# EasyEDA Pro project ProPrj_功率计_2025-02-24.epro

# Schematic Schematic1

## Sheets
1 主控: Create Date: 2023-10-29; Page Name: 主控; Project Name: 功率计; Schematic Name: Schematic1; Update Date: 2024-02-28; Company: 嘉立创EDA; Page Size: A4; Version: V1.0
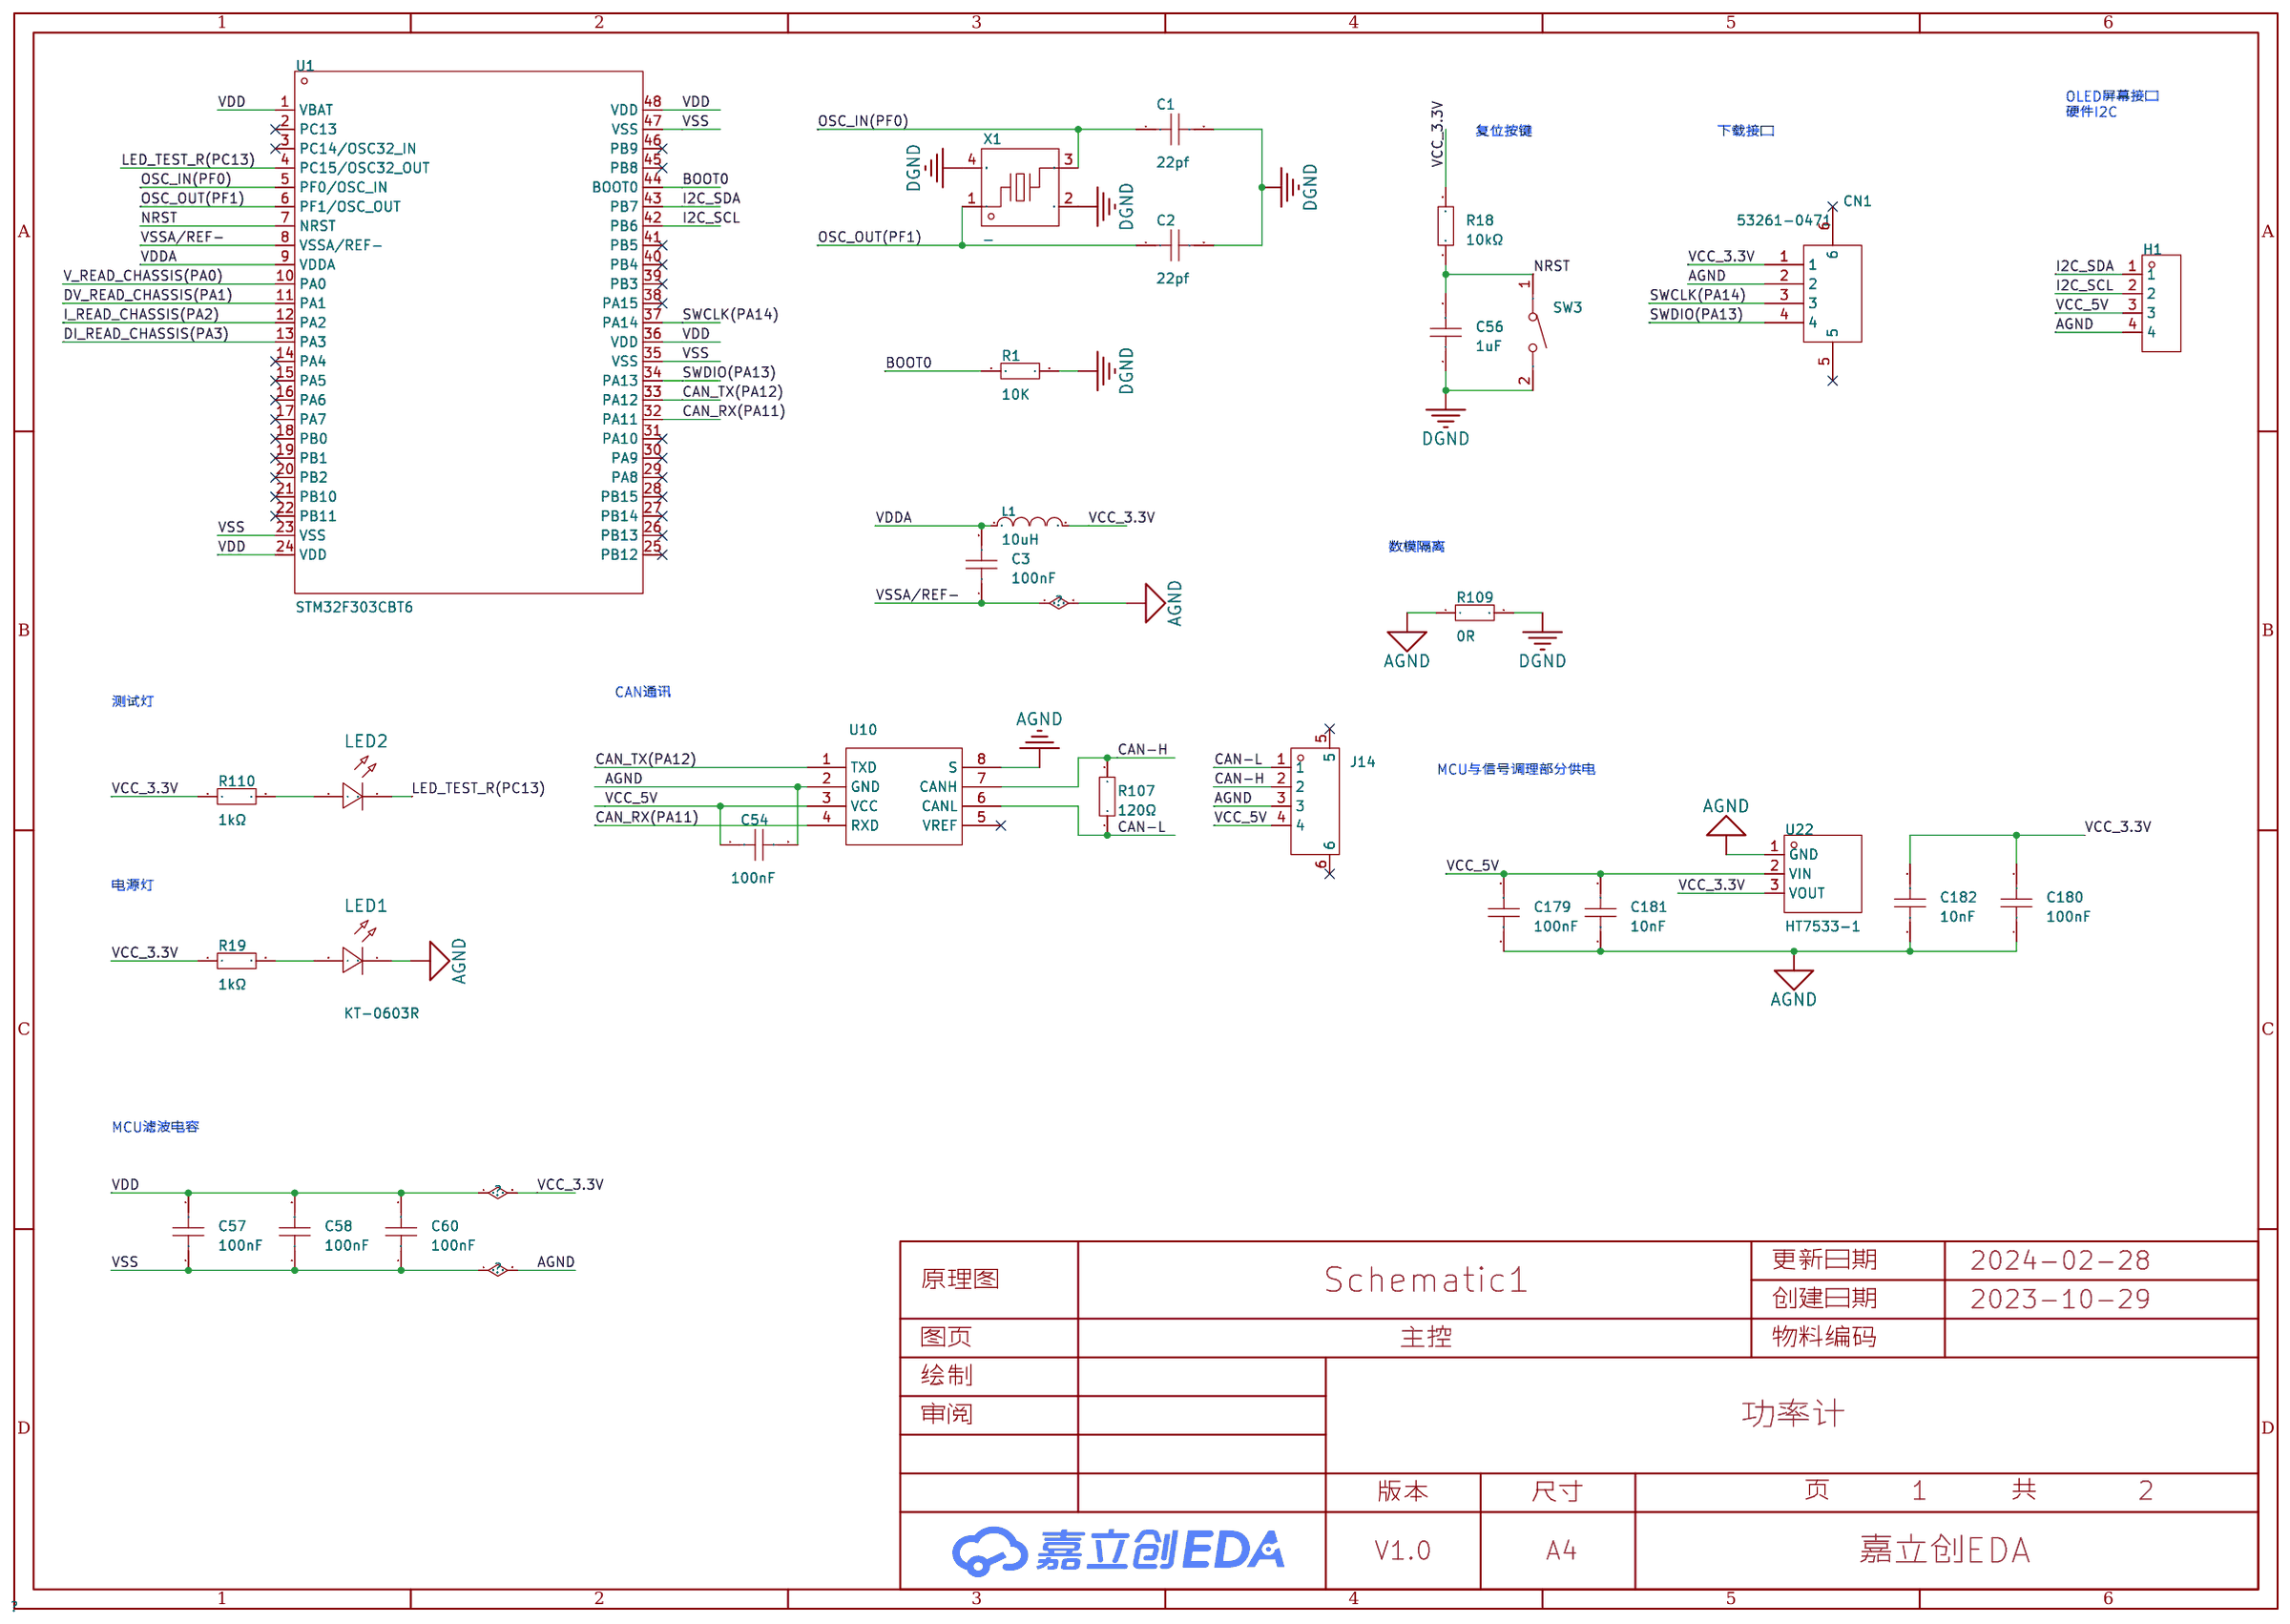
[diagram p0: 主控]
2 信号调理部分: Create Date: 2023-10-30; Page Name: 信号调理部分; Update Date: 2024-03-06
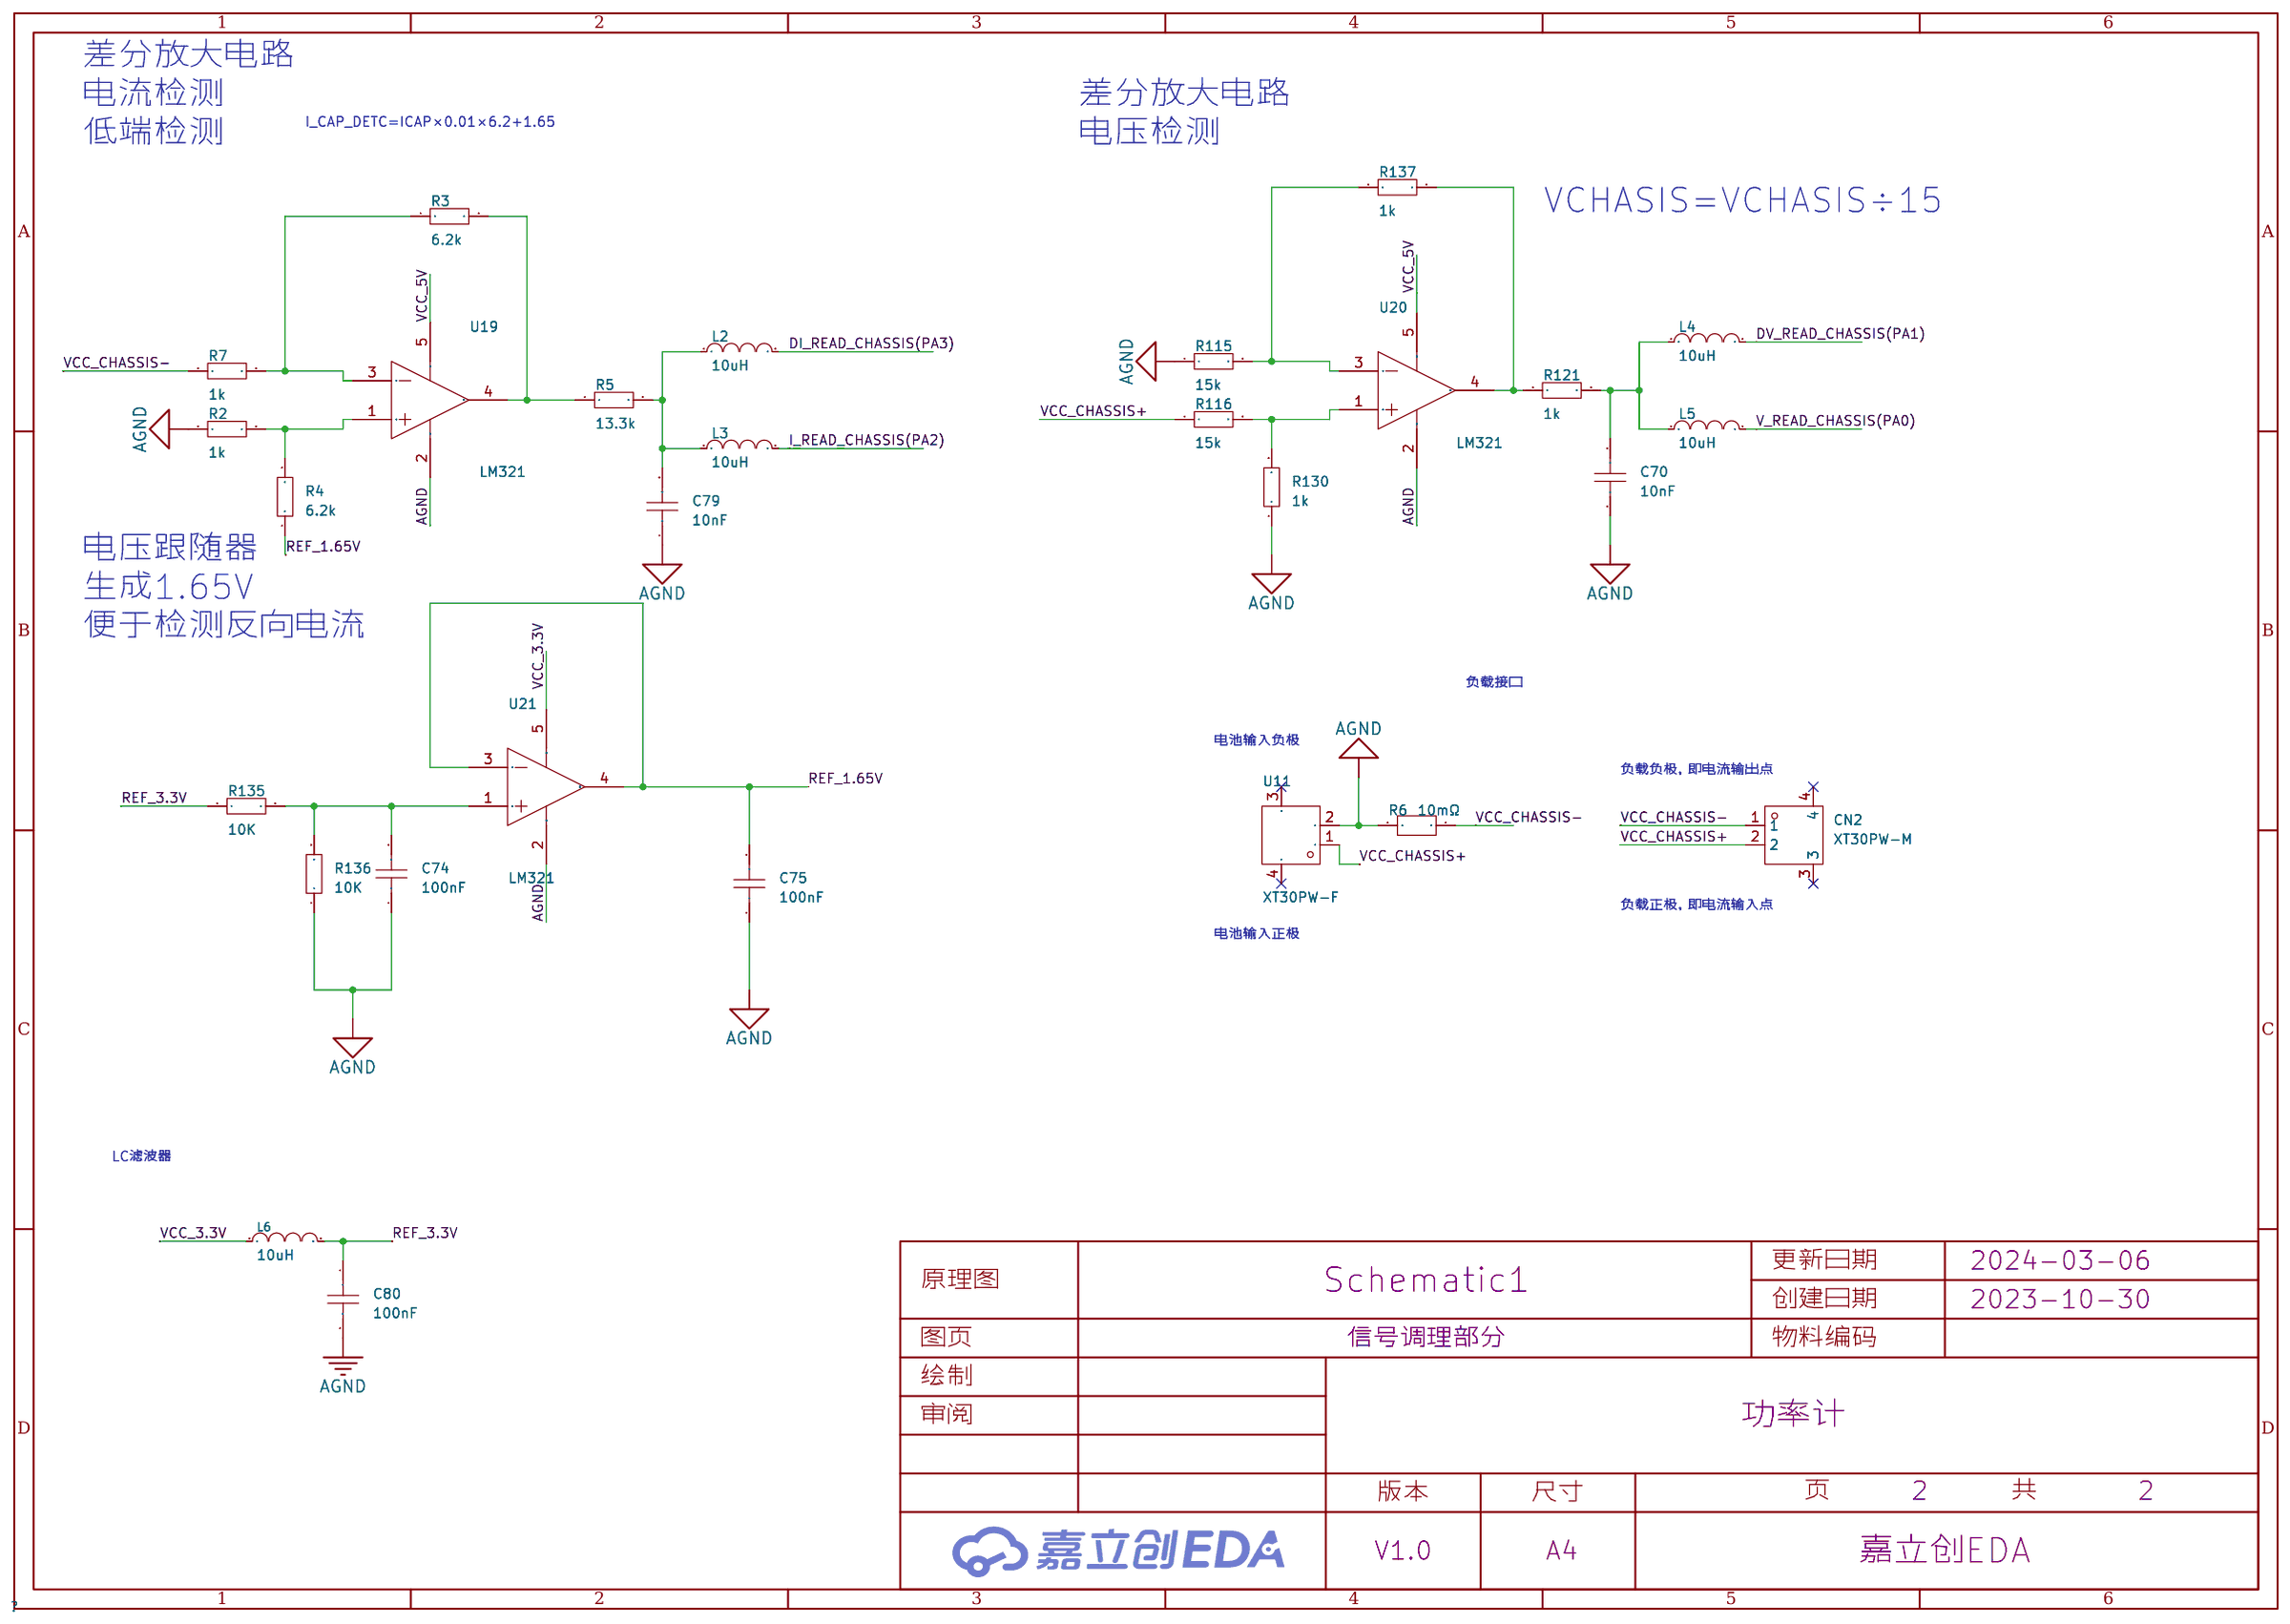
[diagram p1: 信号调理部分]

## Parts
sheet 主控
C1  22pf  [C0603]
C2  22pf  [C0603]
C3  100nF  [C0603]
C54  100nF  [C0603]
C56  1uF  [C0603]
C57  100nF  [C0603]
C58  100nF  [C0603]
C60  100nF  [C0603]
C179  100nF  [C0603]
C180  100nF  [C0603]
C181  10nF  [C0603]
C182  10nF  [C0603]
CN1  53261-0471  [CONN-SMD_4P-1.25_53261X]
H1  -  [HDR-TH_4P-P2.54-V-M]
J14  GH1.25-4P  [CONN-SMD_4P-P1.25_GH1.25-4PLI]
L1  10uH  [L0603]
LED1  KT-0603R  [LED0603-RD]
LED2  KT-0603R  [LED0603-RD]
R1  10K  [R0603]
R18  10kΩ  [R0603]
R19  1kΩ  [R0603]
R107  120Ω  [R0603]
R109  0R  [R0805]
R110  1kΩ  [R0603]
SW3  轻触按键3*4*H  [SW-SMD_L4.0-W2.9-LS5.0]
U1  STM32F303CBT6  [LQFP-48_L7.0-W7.0-P0.50-LS9.0-BL]
U10  -  [SOIC-8_L5.0-W4.0-P1.27-LS6.0-BL]
U22  HT7533-1  [SOT-89_L4.5-W2.5-P1.50-LS4.2-BR]
X1  -  [CRYSTAL-SMD_4P-L3.2-W2.5-BL]
sheet 信号调理部分
C70  10nF  [C0603]
C74  100nF  [C0603]
C75  100nF  [C0603]
C79  10nF  [C0603]
C80  100nF  [C0603]
CN2  XT30PW-M  [CONN-TH_XT30PW-M]
L2  10uH  [L0603]
L3  10uH  [L0603]
L4  10uH  [L0603]
L5  10uH  [L0603]
L6  10uH  [L0603]
R2  1k  [r0402]
R3  6.2k  [R0603]
R4  6.2k  [R0603]
R5  13.3k  [r0402]
R6  10mΩ  [RES-SMD_L6.4-W3.2-R2512]
R7  1k  [r0402]
R115  15k  [r0402]
R116  15k  [r0402]
R121  1k  [r0402]
R130  1k  [R0603]
R135  10K  [r0402]
R136  10K  [r0402]
R137  1k  [R0603]
U11  XT30PW-F  [CONN-TH_XT30PW-F]
U19  LM321  [SOT-23-5_L2.9-W1.6-P0.95-LS2.8-BR]
U20  LM321  [SOT-23-5_L2.9-W1.6-P0.95-LS2.8-BR]
U21  LM321  [SOT-23-5_L2.9-W1.6-P0.95-LS2.8-BR]

## Library data of the parts
C1-C3 C57 C58 C60 C70 C74 C75 C79 C80 C179-C182 = CAP_0603: Supplier Footprint: 0603
C54 = CC0603KRX7R9BB104: 容值:100nF;精度:±10%;额定电压:50V;材质(温度系数):X7R;; LCSC Part Name: 100nF ±10% 50V; Supplier Part: C14663; Manufacturer: YAGEO(国巨); Supplier Footprint: 0603; JLCPCB Part Class: Basic Part; Datasheet: https://atta.szlcsc.com/upload/public/pdf/source/20180910/C282072_33301C7F631E79921B82A8DAC6BCC5B3.pdf; Supplier: LCSC; Tolerance: ±10%; Voltage Rated: 50V; Temperature Coefficient: X7R
C56 = CL10A105KB8NNNC: 容值:1uF;精度:±10%;额定电压:50V;材质(温度系数):X5R;; LCSC Part Name: 1uF ±10% 50V; Supplier Part: C15849; Manufacturer: SAMSUNG(三星); Supplier Footprint: 0603; JLCPCB Part Class: Basic Part; Datasheet: https://atta.szlcsc.com/upload/public/pdf/source/20160103/1457707679084.pdf; Supplier: LCSC; Tolerance: ±10%; Voltage Rated: 50V; Temperature Coefficient: X5R
CN1 = 53261-0471: 其他名称：532610471; LCSC Part Name: 线至板连接器,4触点,针座,1.25mm,表面安装,1排; Supplier Part: C127368; Supplier Footprint: SMD; JLCPCB Part Class: 扩展库; Datasheet: https://atta.szlcsc.com/upload/public/pdf/source/20170914/C127368_1505359400880967666.pdf; Supplier: LCSC
H1 = HDR-M_2.54_1x4P: Supplier Part: C492403; Supplier Footprint: 插件
J14 = GH1.25-4P: Supplier Part: C9900017110; Supplier Footprint: GH1.25MM-4P-SMT-LI; JLCPCB Part Class: 扩展库; Supplier: LCSC
L1 L6 = L_0603
LED1 LED2 = KT-0603R: 发光颜色:红灯;二极管配置:-;透镜颜色:-;主波长:-;色温:-;功率:-;发光角度:-;安装方式:-;工作温度:-40℃~+85℃;; LCSC Part Name: 0603 红灯 高亮; Supplier Part: C2286; Manufacturer: KENTO; Supplier Footprint: 0603; JLCPCB Part Class: Basic Part; Datasheet: https://atta.szlcsc.com/upload/public/pdf/source/20160616/1466072038404.pdf; Supplier: LCSC; Emitted Color: 红灯; Operating Temperature: -40℃~+85℃
R1-R3 R7 R109 R115 R116 R135 R136 = Res_0603: Supplier Footprint: 0603
R18 R19 R110 = 0603WAF1002T5E: 电阻类型:厚膜电阻;阻值:10kΩ;精度:±1%;功率:100mW;; LCSC Part Name: 厚膜电阻 10kΩ ±1% 100mW; Supplier Part: C25804; Manufacturer: UNI-ROYAL(厚声); Supplier Footprint: 0603; JLCPCB Part Class: Basic Part; Datasheet: https://atta.szlcsc.com/upload/public/pdf/source/20200306/C422600_1E6D84923E4A46A82E41ADD87F860B5C.pdf; Supplier: LCSC; Type: 厚膜电阻; Tolerance: ±1%; Power(Watts): 100mW; Temperature Coefficient: ±100ppm/℃; Overload Voltage (Max): 75V; Operating Temperature Range: -55℃~+155℃
R107 = 0402WGF1200TCE: 电阻类型:厚膜电阻;阻值:120Ω;精度:±1%;功率:62.5mW;; LCSC Part Name: 120Ω ±1% 62.5mW; Supplier Part: C25079; Manufacturer: UNI-ROYAL(厚声); Supplier Footprint: 0402; JLCPCB Part Class: Basic Part; Datasheet: https://atta.szlcsc.com/upload/public/pdf/source/20200306/C422600_1E6D84923E4A46A82E41ADD87F860B5C.pdf; Supplier: LCSC; Type: 厚膜电阻; Tolerance: ±1%; Power(Watts): 62.5mW; Temperature Coefficient: ±100ppm/℃; Overload Voltage (Max): 50V; Operating Temperature Range: -55℃~+155℃
SW3 = 轻触按键3*4*H: Supplier Part: C9900017573; Supplier Footprint: 轻触按键3*4*2.5; JLCPCB Part Class: 扩展库; Datasheet: https://atta.szlcsc.comnull; Supplier: LCSC
U1 = STM32F303CBT6: CPU内核:ARM Cortex-M4;CPU最大主频:72MHz;工作电压范围:2V~3.6V;内部振荡器:有;程序 FLASH容量:128K@x8bit;RAM总容量:32KB;EEPROM/数据 FLASH容量:-;GPIO端口数量:37;ADC(单元数/通道数/位数):1@x15ch/12bit;DAC(单元数/通道数/位数):1@x2ch/12bit;外设/功能/协议栈:DMA；看门狗；POR；PWM;工作温度范围:-40℃~+85℃;; LCSC Part Name: ARM Cortex-M4 72MHz 闪存：128K@x8bit RAM：32KB; Supplier Part: C108516; Manufacturer: ST(意法半导体); Supplier Footprint: LQFP-48(7x7); JLCPCB Part Class: 扩展库; Datasheet: https://atta.szlcsc.com/upload/public/pdf/source/20170523/1495533900255.pdf; Supplier: LCSC; CPU Core: ARM Cortex-M4; Maximum Frequency: 72MHz; Supply Voltage Range: 2V~3.6V; Internal Oscillator: 有; Program FLASH Size: 128K@x8bit; RAM Size: 32KB; GPIO Ports Number: 37; ADC (Units/Channels/bits): 1@x15ch/12bit; DAC (Units/Channels/bits): 1@x2ch/12bit; Peripherals / Functions / Protocol Stacks: DMA；看门狗；POR；PWM; Operating Temperature Range: -40℃~+85℃
U10 = TJA1050T/CM,118: 类型:收发器;协议类别:CAN总线;; Supplier Part: C6952; Manufacturer: NXP(恩智浦); Supplier Footprint: SOIC-8_150mil; JLCPCB Part Class: Basic Part; Datasheet: https://atta.szlcsc.com/upload/public/pdf/source/20140411/1457707042917.pdf; Supplier: LCSC; Type: 收发器; Protocol: CAN总线; Supply Voltage: 4.75V ~ 5.25V
U22 = HT7533-1_C347186: 输出类型:固定;最大输入电压:30V;输出电压:3.3V;最大输出电流:100mA;电源纹波抑制比(PSRR):-;输出极性:正极;; LCSC Part Name: 输入30V 输出3.3V 100mA; Supplier Part: C347186; Manufacturer: UMW(友台半导体); Supplier Footprint: SOT-89; JLCPCB Part Class: 扩展库; Datasheet: https://atta.szlcsc.com/upload/public/pdf/source/20231109/E587E38465720CDF1B9E4B203F8DC229.pdf; Supplier: LCSC; Output Type: 固定; Maximum Input Voltage: 30V; Output Voltage: 3.3V; MAX Output Current: 100mA; Dropout Voltage: 100mV@(1mA); standby current: 3uA; Operating Temperature: -25℃~+70℃; Output Polarity: 正极; Number of Outputs: 1
X1 = 1ZNY12000CC0D: 频率:-;负载电容:-;; LCSC Part Name: 12MHz 12pF; Supplier Part: C253729; Manufacturer: KDS(大真空); Supplier Footprint: SMD3225-4P; JLCPCB Part Class: Extended Part; Datasheet: https://atta.szlcsc.com/upload/public/pdf/source/20181030/C253729_3D65CAAD64B48B48AD0EF94E5FE42362.pdf; Supplier: LCSC; Frequency Tolerance: ±10ppm; Frequency Stability: ±30ppm
CN2 = XT30PW-M: Socket,DCsupply,XT30,male,PIN:2; LCSC Part Name: AMASS(艾迈斯)航模插头 卧式弯脚 XT30PW-M公头; Supplier Part: C431092; Manufacturer: AMASS(艾迈斯); JLCPCB Part Class: 扩展库; Datasheet: https://atta.szlcsc.com/upload/public/pdf/source/20220222/6A9F22F7850E25B33E1BE430ADF8560B.pdf; Supplier: LCSC
L2-L5 = L_0402: Supplier Footprint: L0402
R4 R5 R121 R130 R137 = Res_0201: Supplier Footprint: 0201
R6 = HoJLR2512-3W-10mR-1%: 阻值:10mΩ;功率:3W;; LCSC Part Name: 10mΩ 3W; Supplier Part: C2903468; Manufacturer: Milliohm(毫欧); Supplier Footprint: 2512; JLCPCB Part Class: 扩展库; Datasheet: https://atta.szlcsc.com/upload/public/pdf/source/20211009/7525CABAB363C979E942C1DD41F1FEF0.pdf; Supplier: LCSC; Power(Watts): 3W
U11 = XT30PW-F: Supplier Part: C2913282; Supplier Footprint: HDR-1X2; JLCPCB Part Class: 扩展库; Supplier: LCSC
U19-U21 = LM321: 放大器组数:1;输入失调电压(Vos):5mV;增益带宽积(GBP):1MHz;压摆率(SR):0.4V/us;; Supplier Part: C2829424; Manufacturer: CJ(江苏长电/长晶); Supplier Footprint: SOT-23-5; JLCPCB Part Class: 扩展库; Supplier: LCSC; Number of Circuits: 1; Voltage - Input Offset(Vos): 5mV; Gain Bandwidth Product(GBP): 1MHz; Slew Rate(SR): 0.4V/us; Common Mode Rejection Ratio (CMRR): 90dB

## Nets
AGND: C3.1 C54.2 C57.1 C58.1 C60.1 C70.1 C74.1 C75.1 C79.1 C80.2 C179.1 C180.1 C181.1 C182.1 CN1.2 H1.4 J14.3 LED1.1(C) R2.1 R6.2 R109.1 R115.1 R130.1 R136.1 U1.8(VSSA/REF-) U1.23(VSS) U1.35(VSS) U1.47(VSS) U10.2(GND) U10.8(S) U11.2 U19.2(-VS) U20.2(-VS) U21.2(-VS) U22.1(GND)
DGND: C1.2 C2.2 C56.1 R1.2 R109.2 SW3.2 X1.2(GND) X1.4(GND)
VCC_3.3V: C57.2 C58.2 C60.2 C180.2 C182.2 CN1.1 L1.2 L6.1 R18.2 R19.1 R110.1 U1.1(VBAT) U1.24(VDD) U1.36(VDD) U1.48(VDD) U21.5(+VS) U22.3(VOUT)
VCC_5V: C54.1 C179.2 C181.2 H1.3 J14.4 U10.3(VCC) U19.5(+VS) U20.5(+VS) U22.2(VIN)
VCC_CHASSIS+: CN2.2 R116.1 U11.1
VCC_CHASSIS-: CN2.1 R6.1 R7.1
VDDA: C3.2 L1.1 U1.9(VDDA)
BOOT0: R1.1 U1.44(BOOT0)
CAN-H: J14.2 R107.2 U10.7(CANH)
CAN-L: J14.1 R107.1 U10.6(CANL)
CAN_RX(PA11): U1.32(PA11) U10.4(RXD)
CAN_TX(PA12): U1.33(PA12) U10.1(TXD)
DI_READ_CHASSIS(PA3): L2.2 U1.13(PA3)
DV_READ_CHASSIS(PA1): L4.2 U1.11(PA1)
I2C_SCL: H1.2 U1.42(PB6)
I2C_SDA: H1.1 U1.43(PB7)
I_READ_CHASSIS(PA2): L3.2 U1.12(PA2)
LED_TEST_R(PC13): LED2.1(C) U1.4(PC15/OSC32_OUT)
NRST: C56.2 R18.1 SW3.1 U1.7(NRST)
OSC_IN(PF0): C1.1 U1.5(PF0/OSC_IN) X1.3
OSC_OUT(PF1): C2.1 U1.6(PF1/OSC_OUT) X1.1
REF_1.65V: C75.2 R4.1 U21.3(-IN) U21.4(OUT)
REF_3.3V: C80.1 L6.2 R135.1
SWCLK(PA14): CN1.3 U1.37(PA14)
SWDIO(PA13): CN1.4 U1.34(PA13)
V_READ_CHASSIS(PA0): L5.2 U1.10(PA0)
$1N1993: LED2.2(A) R110.2
$1N7781: LED1.2(A) R19.2
$3N1220: R3.1 R7.2 U19.3(-IN)
$3N1238: R3.2 R5.1 U19.4(OUT)
$3N1710: R2.2 R4.2 U19.1(+IN)
$3N1779: R116.2 R130.2 U20.1(+IN)
$3N2669: C79.2 L2.1 L3.1 R5.2
$3N2760: C70.2 L4.1 L5.1 R121.2
$3N5622: C74.2 R135.2 R136.2 U21.1(+IN)
$3N6218: R115.2 R137.2 U20.3(-IN)
$3N6231: R121.1 R137.1 U20.4(OUT)

Not connected (* = marked no-connect by the designer): CN1 5* 6*; CN2 3* 4*; J14 5* 6*; U1 2(PC13)* 3(PC14/OSC32_IN)* 14(PA4)* 15(PA5)* 16(PA6)* 17(PA7)* 18(PB0)* 19(PB1)* 20(PB2)* 21(PB10)* 22(PB11)* 25(PB12)* 26(PB13)* 27(PB14)* 28(PB15)* 29(PA8)* 30(PA9)* 31(PA10)* 38(PA15)* 39(PB3)* 40(PB4)* 41(PB5)* 45(PB8)* 46(PB9)*; U10 5(VREF)*; U11 3* 4*

## Notes on the sheets
sheet 1
- OLED屏幕接口
  硬件I2C
- 复位按键
- 下载接口
- 数模隔离
- 测试灯
- CAN通讯
- MCU与信号调理部分供电
- 电源灯
- MCU滤波电容
sheet 2
- I_CAP_DETC=ICAP×0.01×6.2+1.65
- 差分放大电路
  电流检测
  低端检测
- 差分放大电路
  电压检测
- VCHASIS=VCHASIS÷15
- 电压跟随器
  生成1.65V
  便于检测反向电流
- 负载接口
- 电池输入负极
- 负载负极，即电流输出点
- 负载正极，即电流输入点
- 电池输入正极
- LC滤波器

# Board PCB1
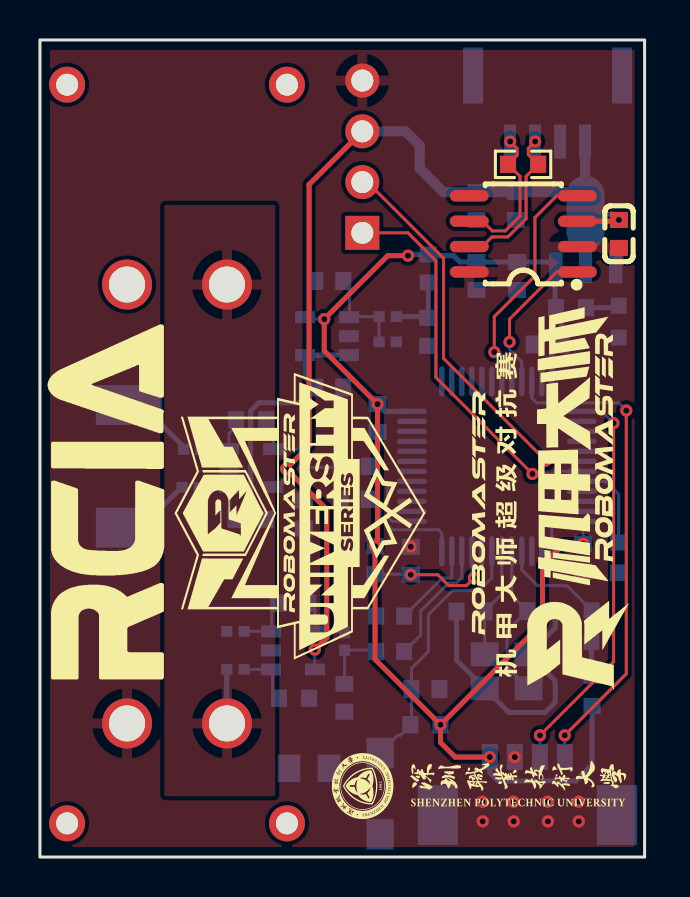
[diagram p2: board, top side]
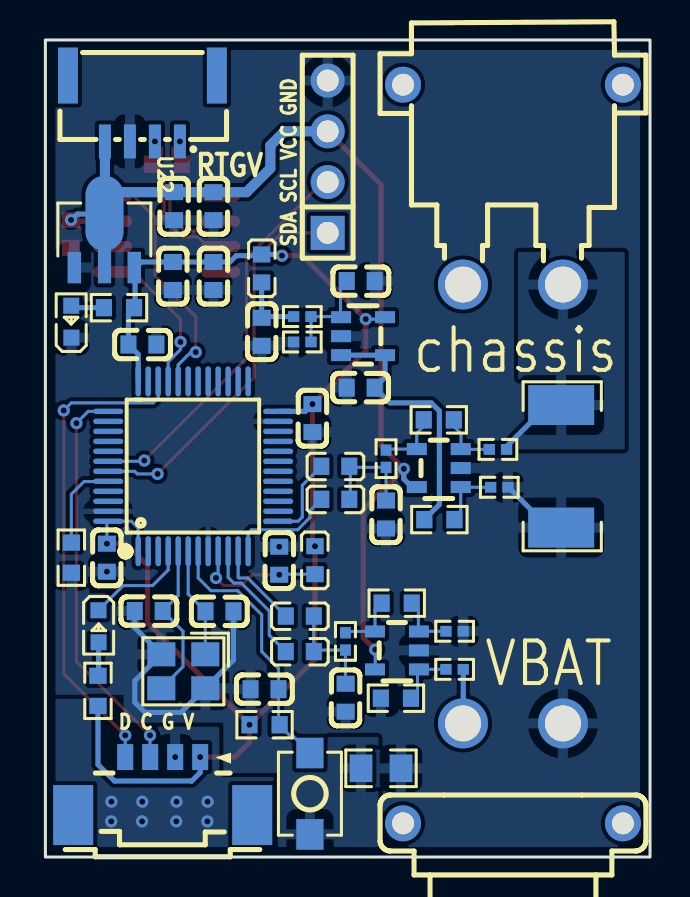
[diagram p3: board, bottom side, seen from below]

Outline 30.25 x 40.89 mm; copper layers: Top Layer, Bottom Layer. Coordinates in mm from the lower left corner of the outline.
Outline path: rectangle 0,40.89 30.25,0
Stack: Top Layer 0.035mm / Dielectric1 1.51mm FR4 er 4.5 / Bottom Layer 0.035mm

## Design rules (mm)
net CAN-L: DP1
net CAN-H: DP1
template: 自定义配置
spacing copperThickness1oz (default): track to track 0.102, other pairs 0.152 to 0.3
spacing copperThickness2oz: track to track 0.203, other pairs 0.152 to 0.3
track width copperThickness1oz (default): min 0.127, default 0.254, max 25.4
track width copperThickness2oz: min 0.203, default 0.254, max 2.54
differential pair differentialPair (default): width min 0.127, default 0.254, max 2.54; gap min 0.152, default 0.152
via viaSize (default): diameter min 0.5, default 0.61, max 10; hole min 0.3, default 0.305, max 6.299

## Placement (name value [footprint] x y rotation side)
C1  22pf  [C0603]  25.08 12.31 0 bottom
C2  22pf  [C0603]  21.54 12.29 180 bottom
C3  100nF  [C0603]  18.55 14.83 270 bottom
C54  100nF  [C0603]  28.97 31.18 270 top
C56  1uF  [C0603]  19.29 8.4 180 bottom
C57  100nF  [C0603]  16.89 21.97 90 bottom
C58  100nF  [C0603]  25.4 25.65 0 bottom
C60  100nF  [C0603]  27.18 14.98 90 bottom
C70  10nF  [C0603]  15.23 7.97 90 bottom
C74  100nF  [C0603]  14.48 28.82 0 bottom
C75  100nF  [C0603]  14.48 23.49 180 bottom
C79  10nF  [C0603]  13.21 17.14 90 bottom
C80  100nF  [C0603]  19.43 26.28 270 bottom
C179  100nF  [C0603]  21.84 32.57 90 bottom
C180  100nF  [C0603]  21.84 29.08 90 bottom
C181  10nF  [C0603]  23.81 32.57 90 bottom
C182  10nF  [C0603]  23.88 29.08 90 bottom
CN1  53261-0471  [CONN-SMD_4P-1.25_53261X]  24.38 3.55 180 bottom
CN2  XT30PW-M  [CONN-TH_XT30PW-M]  6.86 33.65 0 bottom
H1  -  [HDR-TH_4P-P2.54-V-M]  16.13 35.05 90 bottom
J14  GH1.25-4P  [CONN-SMD_4P-P1.25_GH1.25-4PLI]  25.4 37.46 0 bottom
L1  10uH  [L0603]  16.76 14.85 90 bottom
L2  10uH  [L0603]  15.75 19.55 0 bottom
L3  10uH  [L0603]  15.75 17.9 0 bottom
L4  10uH  [L0603]  17.53 12.06 0 bottom
L5  10uH  [L0603]  17.53 10.28 0 bottom
L6  10uH  [L0603]  19.43 29.46 270 bottom
LED1  KT-0603R  [LED0603-RD]  28.96 26.79 90 bottom
LED2  KT-0603R  [LED0603-RD]  27.6 11.55 270 bottom
R1  10K  [R0603]  28.96 14.98 270 bottom
R2  1k  [r0402]  7.54 18.5 0 bottom
R3  6.2k  [R0603]  10.57 21.88 0 bottom
R4  6.2k  [R0603]  10.54 16.89 180 bottom
R5  13.3k  [r0402]  13.21 19.93 270 bottom
R6  10mΩ  [RES-SMD_L6.4-W3.2-R2512]  4.44 19.55 270 bottom
R7  1k  [r0402]  7.61 20.4 0 bottom
R18  10kΩ  [R0603]  19.29 6.62 0 bottom
R19  1kΩ  [R0603]  26.57 27.49 0 bottom
R107  120Ω  [R0603]  24.17 34.67 0 top
R109  0R  [R0805]  13.46 4.44 0 bottom
R110  1kΩ  [R0603]  27.62 8.32 90 bottom
R115  15k  [r0402]  9.78 11.3 0 bottom
R116  15k  [r0402]  9.78 9.39 0 bottom
R121  1k  [r0402]  15.24 10.79 270 bottom
R130  1k  [R0603]  12.71 7.95 180 bottom
R135  10K  [r0402]  17.4 27.05 180 bottom
R136  10K  [r0402]  17.4 25.78 180 bottom
R137  1k  [R0603]  12.67 12.7 180 bottom
SW3  轻触按键3*4*H  [SW-SMD_L4.0-W2.9-LS5.0]  17.02 3.17 270 bottom
U1  STM32F303CBT6  [LQFP-48_L7.0-W7.0-P0.50-LS9.0-BL]  22.86 19.55 180 bottom
U10  -  [SOIC-8_L5.0-W4.0-P1.27-LS6.0-BL]  24.19 31.18 90 top
U11  XT30PW-F  [CONN-TH_XT30PW-F]  6.86 4.19 180 bottom
U19  LM321  [SOT-23-5_L2.9-W1.6-P0.95-LS2.8-BR]  10.57 19.46 180 bottom
U20  LM321  [SOT-23-5_L2.9-W1.6-P0.95-LS2.8-BR]  12.66 10.34 180 bottom
U21  LM321  [SOT-23-5_L2.9-W1.6-P0.95-LS2.8-BR]  14.36 26.07 0 bottom
U22  HT7533-1  [SOT-89_L4.5-W2.5-P1.50-LS4.2-BR]  27.3 30.86 270 bottom
X1  -  [CRYSTAL-SMD_4P-L3.2-W2.5-BL]  23.35 9.29 0 bottom

## Footprints (pads in the part's own frame, mm; a bottom-side part is the same pattern mirrored in y, then rotated)
C0603
  rect 0.8x0.9 smd: 1(-0.7,0) 2(0.7,0)
CONN-SMD_4P-1.25_53261X
  rect 0.8x1.3 smd: 1(1.875,1.452) 2(0.625,1.452) 3(-0.625,1.452) 4(-1.875,1.452)
  rect 2x3 smd: 5(-4.479,-1.452) 6(4.479,-1.452)
CONN-SMD_4P-P1.25_GH1.25-4PLI
  rect 0.6x1.7 smd: 1(-1.875,1.65) 2(-0.625,1.65) 3(0.625,1.65) 4(1.875,1.65)
  rect 1x2.8 smd: 5(-3.725,-1.65) 6(3.725,-1.65)
CONN-TH_XT30PW-F
  round 2.5 hole 1.8: 1(-2.5,2.5) 2(2.5,2.5)
  round 1.8 hole 1.1: 3(5.5,-2.5) 4(-5.5,-2.5)
CONN-TH_XT30PW-M
  round 2.5 hole 1.8: 1(-2.5,5) 2(2.5,5)
  round 1.8 hole 1.1: 3(5.5,-5) 4(-5.5,-5)
CRYSTAL-SMD_4P-L3.2-W2.5-BL
  rect 1.4x1.2 smd: 1(-1.1,-0.85) 2(1.1,-0.85) 3(1.1,0.85) 4(-1.1,0.85)
HDR-TH_4P-P2.54-V-M
  rect 1.7x1.7 hole 1.1: 1(-3.81,0)
  round 1.7 hole 1.1: 2(-1.27,0) 3(1.27,0) 4(3.81,0)
L0603
  rect 0.8x0.864 smd: 1(-0.7,0) 2(0.7,0)
LED0603-RD
  rect 0.8x0.8 smd: 1(-0.799,-0.004) 2(0.799,0.004)
LQFP-48_L7.0-W7.0-P0.50-LS9.0-BL
  oval 0.27x1.5 smd: 1(-2.75,-4.25) 2(-2.25,-4.25) 3(-1.75,-4.25) 4(-1.25,-4.25) 5(-0.75,-4.25) 6(-0.25,-4.25) 7(0.25,-4.25) 8(0.75,-4.25) 9(1.25,-4.25) 10(1.75,-4.25) 11(2.25,-4.25) 12(2.75,-4.25) 25(2.75,4.25) 26(2.25,4.25) 27(1.75,4.25) 28(1.25,4.25) 29(0.75,4.25) 30(0.25,4.25) 31(-0.25,4.25) 32(-0.75,4.25) 33(-1.25,4.25) 34(-1.75,4.25) 35(-2.25,4.25) 36(-2.75,4.25)
  oval 1.5x0.27 smd: 13(4.25,-2.75) 14(4.25,-2.25) 15(4.25,-1.75) 16(4.25,-1.25) 17(4.25,-0.75) 18(4.25,-0.25) 19(4.25,0.25) 20(4.25,0.75) 21(4.25,1.25) 22(4.25,1.75) 23(4.25,2.25) 24(4.25,2.75) 37(-4.25,2.75) 38(-4.25,2.25) 39(-4.25,1.75) 40(-4.25,1.25) 41(-4.25,0.75) 42(-4.25,0.25) 43(-4.25,-0.25) 44(-4.25,-0.75) 45(-4.25,-1.25) 46(-4.25,-1.75) 47(-4.25,-2.25) 48(-4.25,-2.75)
r0402
  rect 0.566x0.54 smd: 1(-0.433,0) 2(0.433,0)
R0603
  rect 0.806x0.864 smd: 1(-0.753,0) 2(0.753,0)
R0805
  rect 1.133x1.377 smd: 1(-1,0) 2(1,0)
RES-SMD_L6.4-W3.2-R2512
  rect 2x3.3 smd: 1(-3.067,0) 2(3.067,0)
SOIC-8_L5.0-W4.0-P1.27-LS6.0-BL
  oval 0.569x1.95 smd: 1(-1.905,-2.705) 2(-0.635,-2.705) 3(0.635,-2.705) 4(1.905,-2.705) 5(1.905,2.705) 6(0.635,2.705) 7(-0.635,2.705) 8(-1.905,2.705)
SOT-23-5_L2.9-W1.6-P0.95-LS2.8-BR
  rect 1x0.6 smd: 1(1.1,-0.95) 2(1.1,0) 3(1.1,0.95) 4(-1.1,0.95) 5(-1.1,-0.95)
SOT-89_L4.5-W2.5-P1.50-LS4.2-BR
  rect 1.575x0.672 smd: 1(1.356,-1.5) 3(1.356,1.5)
  custom 5.377x1.9 smd: 2(-1.356,0.009)
SW-SMD_L4.0-W2.9-LS5.0
  rect 1.53x1.36 smd: 1(-2.035,0) 2(2.035,0)

## Nets
As in the schematic.

Pads without a net: CN1 5 6; CN2 3 4; J14 5 6; U1 2 3 14 15 16 17 18 19 20 21 22 25 26 27 28 29 30 31 38 39 40 41 45 46; U10 5; U11 3 4

## Via types
v1: diameter 0.61, hole 0.305, Top Layer to Bottom Layer, 33 vias

## Routing (per net, layer and track width the routed paths; a pad name or vN(x,y) marks a point on that pad's centre or on a via; arc(x,y) is an arc through that point)
AGND: length 3.5
  Bottom Layer w0.254: R6.2 5.3,17.34 5.91,17.34 7.08,18.5 R2.1
  vias: v1(18.55,15.53) v1(22.14,2.77) v1(22.15,1.78) v1(23.69,2.77) v1(23.71,1.78) v1(23.76,5) v1(25.41,2.77) v1(25.42,1.78) v1(26.95,2.77) v1(26.96,1.78) v1(27.18,14.28)
DGND: length 14.3
  Bottom Layer w0.254: C1.2 25.78,11.47 X1.2 25.78,8.82 25.78,7.74 25.27,7.23 23.46,7.23 X1.4 20.84,9.85 C2.2
VCC_3.3V: length 74.4
  Top Layer w0.254: v1(20.04,6.62) 25.15,11.72 25.15,14.6 26.23,15.68 v1(27.18,15.68) ; v1(20.04,6.62) 16.76,9.9 v1(16.76,15.55) 16.89,15.68 v1(16.89,22.67) 14.22,25.33 v1(14.22,26.92) 17.4,30.09 v1(18.41,30.09) ; v1(20.04,6.62) 20.04,5.73 20.77,5 v1(22.51,5)
  Bottom Layer w0.152: v1(14.22,26.92) 13.36,26.92 13.26,27.01 ; U1.1 25.61,16.46 25.95,16.8 U1.48 27.18,16.73 v1(27.18,15.68)
  Bottom Layer w0.254: R110.1 27.62,4.63 26.8,3.8 22.93,3.8 22.51,4.23 v1(22.51,5) ; U1.36 25.61,25.16 C58.2 26.1,27.21 R19.1 25.77,27.54 25.77,29.46 25.45,29.78 C182.2 C180.2 21.02,29.78 20.7,30.09 19.5,30.09 L6.1 18.48,30.16 v1(18.41,30.09) ; U1.24 17.25,22.3 v1(16.89,22.67)
VCC_5V: length 52.4
  Top Layer w0.254: v1(13.75,10.38) 14.35,10.98 14.35,17.39 v1(12.32,19.43) 13.46,20.57 13.46,33.65 H1.3 ; 26.85,31.82 28.9,31.82 v1(28.97,31.88)
  Bottom Layer w0.152: v1(13.75,10.38) 13.75,9.4 U20.5
  Bottom Layer w0.254: v1(12.32,19.43) 12.32,18.92 11.92,18.51 U19.5 ; 27.27,32.18 28.65,32.18 28.96,31.87
  Bottom Layer w0.508: H1.3 18.29,36.32 19,35.61 19,34.46 20.19,33.27 C179.2 C181.2 26.79,33.27 27.27,32.8 27.27,32.18 27.27,32.18 J14.4
VCC_CHASSIS+: length 2.7
  Bottom Layer w0.254: U11.1 9.35,6.7 R116.1
VCC_CHASSIS-: length 3.7
  Bottom Layer w0.254: R7.1 7.18,20.55 5.96,21.76 5.3,21.76 R6.1
VDDA: length 6.7
  Top Layer w0.152: v1(21.72,13.96) 21.34,13.58 20.45,13.58 19.9,14.13 v1(18.55,14.13)
  Bottom Layer w0.152: U1.9 21.61,14.07 v1(21.72,13.96) ; L1.1 18.53,14.15 v1(18.55,14.13)
BOOT0: length 4.5
  Bottom Layer w0.152: R1.1 28.96,18.16 28.32,18.79 27.12,18.79 U1.44
CAN-H: length 7.9
  Top Layer w0.152: U10.7 22.13,30.55 22.61,31.03 23.41,31.03 24.32,31.95 24.32,34.06 R107.2 24.44,35.16 24.44,35.47 v1(24.77,35.81)
CAN-L: length 7.4
  Top Layer w0.152: v1(23.52,35.81) 23.88,35.46 23.88,35.12 R107.1 24.02,34.06 24.02,32.07 23.28,31.34 22.63,31.34 22.15,31.82 U10.6
CAN_RX(PA11): length 12.1
  Top Layer w0.152: v1(22.73,25.27) 22.73,27.05 24.76,29.08 24.76,32 25.85,33.09 U10.4
  Bottom Layer w0.152: v1(22.73,25.27) 22.97,25.27 23.61,24.63 U1.32
CAN_TX(PA12): length 7.7
  Top Layer w0.152: U10.1 25.85,29.28 23.49,26.92 v1(23.49,25.78)
  Bottom Layer w0.152: v1(23.49,25.78) 23.49,25.39 24.11,24.78 U1.33
DI_READ_CHASSIS(PA3): length 4.2
  Bottom Layer w0.152: U1.13 17.61,16.8 17.4,17.01 17.4,18.6 L2.2
DV_READ_CHASSIS(PA1): length 4.5
  Bottom Layer w0.152: U1.11 20.61,14 20.57,13.96 20.13,13.96 L4.2
I2C_SCL: length 19.7
  Top Layer w0.152: v1(25.31,19.84) 20.19,24.95 20.19,29.97 16.38,33.78 H1.2
  Bottom Layer w0.152: v1(25.31,19.84) 25.34,19.8 U1.42
I2C_SDA: length 19.5
  Top Layer w0.152: v1(24.64,19.17) 19.81,24 19.81,29.84 18.41,31.24 H1.1
  Bottom Layer w0.152: v1(24.64,19.17) 25.65,19.17 25.78,19.3 U1.43
I_READ_CHASSIS(PA2): length 5.5
  Bottom Layer w0.152: U1.12 20.11,16.21 19.94,16.38 17.63,16.38 17.02,16.99 17.02,17.33 L3.2
LED_TEST_R(PC13): length 5.3
  Bottom Layer w0.152: U1.4 24.11,14.37 24.89,13.58 26.36,13.58 27.6,12.35
NRST: length 13.3
  Bottom Layer w0.152: U1.7 22.61,13.97 21.97,13.33 20.64,13.33 19.43,12.12 19.43,10.28 18.59,9.44 C56.2 18.59,6.67 R18.1 18.53,6.59 18.03,6.09 17.9,6.09 SW3.1
OSC_IN(PF0): length 8
  Bottom Layer w0.152: X1.3 23.37,9.53 23.37,11.3 C1.1 23.61,13.08 U1.5
OSC_OUT(PF1): length 5.5
  Bottom Layer w0.152: X1.1 22.25,12.28 C2.1 23.11,13.16 U1.6
REF_1.65V: length 13.5
  Bottom Layer w0.254: U21.3 U21.4 13.26,24.01 C75.2 13.02,22.73 10.95,22.73 10.54,22.32 10.54,17.64 R4.1
REF_3.3V: length 3.4
  Bottom Layer w0.254: L6.2 19.43,26.99 C80.1 19.37,27.05 R135.1
SWCLK(PA14): length 20.1
  Top Layer w0.152: v1(25.02,6.09) 28.7,9.77 v1(28.7,21.71)
  Bottom Layer w0.152: v1(28.7,21.71) 28.11,22.3 U1.37 ; v1(25.02,6.09) 25.02,5.01 CN1.3
SWDIO(PA13): length 24.4
  Top Layer w0.152: v1(29.34,22.35) 29.34,9.17 v1(26.26,6.09)
  Bottom Layer w0.152: v1(29.34,22.35) 28.96,22.73 24.86,22.73 24.61,22.98 U1.34 ; CN1.4 v1(26.26,6.09)
V_READ_CHASSIS(PA0): length 6.4
  Bottom Layer w0.152: U1.10 21.11,13.99 20.83,13.71 20.45,13.71 19.05,12.31 19.05,11.11 L5.2
$1N1993: length 1.7
  Bottom Layer w0.254: LED2.2 27.59,9.1 R110.2
$1N7781: length 1.7
  Bottom Layer w0.254: LED1.2 28.86,27.49 27.32,27.49
$3N1220: length 3.2
  Bottom Layer w0.152: 9.46,20.4 U19.3 ; 9.46,20.4 R7.2 ; 9.46,20.4 9.46,21.2 10.14,21.88
$3N1238: length 3.3
  Bottom Layer w0.152: 11,21.88 11.67,21.21 U19.4 13.16,20.41 R5.1
$3N1710: length 3.5
  Bottom Layer w0.152: 10.11,16.89 9.91,16.89 9.47,17.32 U19.1 9.46,18.5 R2.2
$3N1779: length 3
  Bottom Layer w0.152: 11.99,7.95 11.63,8.3 11.63,9.32 U20.1 11.56,9.39 R116.2
$3N2669: length 5.1
  Bottom Layer w0.152: 15,19.5 R5.2 C79.2 ; 15,19.5 15,17.95 L3.1 ; 15,19.5 L2.1
$3N2760: length 5.1
  Bottom Layer w0.152: C70.2 15.24,8.68 R121.2 16.75,10.36 L5.1 L4.1
$3N5622: length 4.5
  Bottom Layer w0.152: R135.2 R136.2 ; 16.84,27.05 15.49,27.05 15.49,28.51 C74.2
$3N6218: length 2.9
  Bottom Layer w0.152: 11.55,11.3 11.59,11.34 11.59,12.38 R137.2 ; 11.55,11.3 R115.2 ; 11.55,11.3 U20.3
$3N6231: length 3.1
  Bottom Layer w0.152: R121.1 15.17,11.29 U20.4 13.76,12.37 R137.1

## Copper pours and planes (outline as drawn; the poured copper is in the pictures)
AGND on Top Layer: -2.41,44.7 33.53,44.7 33.78,44.44 33.78,-1.02 30.48,-4.32 0.13,-4.32 -2.79,-1.4 -2.79,44.32
AGND on Bottom Layer: -2.79,45.71 34.8,45.71 35.31,46.22 35.69,45.84 35.69,-3.94 35.18,-4.45 -2.41,-4.45 -2.79,-4.07
DGND on Bottom Layer: 29.85,14.98 29.85,8.12 26.34,8.12 26.34,6.73 21.39,6.73 21.35,6.68 21.35,4.2 18.62,4.2 18.62,0.16 13.59,0.16 13.59,6.01 17.02,6.01 17.02,9.27 19.18,9.27 19.18,13.2 28.07,13.2 28.07,14.98
VCC_CHASSIS+ on Top Layer: 6.22,32.63 11.77,32.63 11.77,3.04 6.22,3.04
VCC_CHASSIS- on Bottom Layer: 1.29,30.28 6.6,30.28 6.6,20.4 1.27,20.4 1.27,30.27

## Text on the board
Bottom Silkscreen Layer: SDA SCL VCC GND | D C G V | RTGV | VBAT | chassis
